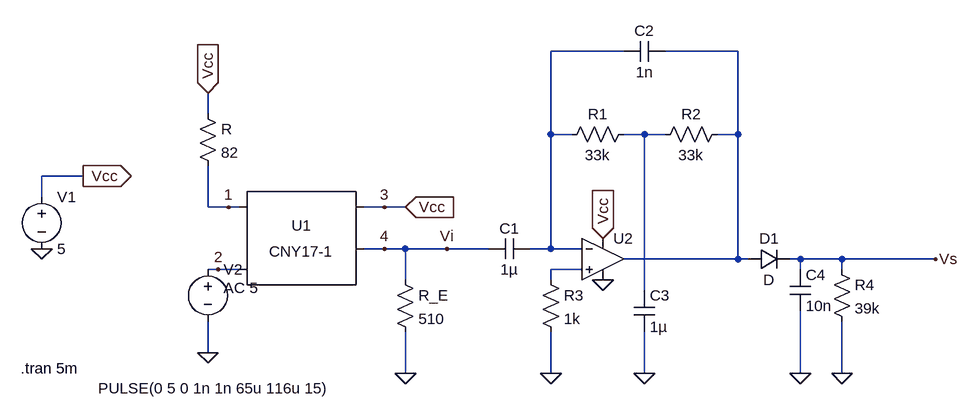
[diagram p0: schematic Recepteur_v1.asc]
Recepteur_v1.asc, the LTspice schematic file:
Version 4
SHEET 1 1756 680
WIRE 832 -112 720 -112
WIRE 1008 -112 896 -112
WIRE 192 -16 192 -48
WIRE 720 16 720 -112
WIRE 752 16 720 16
WIRE 864 16 832 16
WIRE 896 16 864 16
WIRE 1008 16 1008 -112
WIRE 1008 16 976 16
WIRE 0 80 -64 80
WIRE -64 112 -64 80
WIRE 192 128 192 64
WIRE 224 128 192 128
WIRE 240 128 224 128
WIRE 464 128 432 128
WIRE 496 128 464 128
WIRE 464 192 432 192
WIRE 496 192 464 192
WIRE 560 192 496 192
WIRE 624 192 560 192
WIRE 720 192 720 16
WIRE 720 192 688 192
WIRE 768 192 720 192
WIRE 1008 208 1008 16
WIRE 1008 208 832 208
WIRE 1024 208 1008 208
WIRE 1104 208 1088 208
WIRE 1168 208 1104 208
WIRE 1312 208 1168 208
WIRE 208 224 192 224
WIRE 240 224 208 224
WIRE 768 224 720 224
WIRE 1104 224 1104 208
WIRE 1168 224 1168 208
WIRE 496 240 496 192
WIRE 720 240 720 224
WIRE 864 256 864 16
WIRE 192 352 192 304
WIRE 496 384 496 320
WIRE 720 384 720 320
WIRE 864 384 864 320
WIRE 1104 384 1104 288
WIRE 1168 384 1168 304
FLAG -64 192 0
FLAG 0 80 Vcc
IOPIN 0 80 Out
FLAG 192 -48 Vcc
IOPIN 192 -48 In
FLAG 192 352 0
FLAG 496 384 0
FLAG 496 128 Vcc
IOPIN 496 128 In
FLAG 560 192 Vi
FLAG 720 384 0
FLAG 864 384 0
FLAG 800 176 Vcc
IOPIN 800 176 In
FLAG 800 240 0
FLAG 1104 384 0
FLAG 1168 384 0
FLAG 1312 208 Vs
FLAG 224 128 1
FLAG 208 224 2
FLAG 464 128 3
FLAG 464 192 4
SYMBOL voltage -64 96 R0
WINDOW 123 0 0 Left 2
WINDOW 39 0 0 Left 2
SYMATTR InstName V1
SYMATTR Value 5
SYMBOL Optos\\CNY17-1 336 192 R0
SYMATTR InstName U1
SYMBOL res 176 -32 R0
SYMATTR InstName R
SYMATTR Value 82
SYMBOL voltage 192 208 R0
WINDOW 3 -169 199 Left 2
WINDOW 123 24 44 Left 2
WINDOW 39 0 0 Left 2
SYMATTR Value PULSE(0 5 0 1n 1n 65u 116u 15)
SYMATTR Value2 AC 5
SYMATTR InstName V2
SYMBOL res 480 224 R0
SYMATTR InstName R_E
SYMATTR Value 510
SYMBOL cap 688 176 R90
WINDOW 0 0 32 VBottom 2
WINDOW 3 32 32 VTop 2
SYMATTR InstName C1
SYMATTR Value 1µ
SYMBOL res 848 0 R90
WINDOW 0 0 56 VBottom 2
WINDOW 3 32 56 VTop 2
SYMATTR InstName R1
SYMATTR Value 33k
SYMBOL res 992 0 R90
WINDOW 0 0 56 VBottom 2
WINDOW 3 32 56 VTop 2
SYMATTR InstName R2
SYMATTR Value 33k
SYMBOL cap 896 -128 R90
WINDOW 0 0 32 VBottom 2
WINDOW 3 32 32 VTop 2
SYMATTR InstName C2
SYMATTR Value 1n
SYMBOL Opamps\\UniversalOpamp2 800 208 R0
SYMATTR InstName U2
SYMBOL res 704 224 R0
SYMATTR InstName R3
SYMATTR Value 1k
SYMBOL cap 848 256 R0
SYMATTR InstName C3
SYMATTR Value 1µ
SYMBOL diode 1024 224 R270
WINDOW 0 32 32 VTop 2
WINDOW 3 0 32 VBottom 2
SYMATTR InstName D1
SYMBOL cap 1088 224 R0
SYMATTR InstName C4
SYMATTR Value 10n
SYMBOL res 1152 208 R0
SYMATTR InstName R4
SYMATTR Value 39k
TEXT -96 376 Left 2 !.tran 5m

The netlist it stands for:
* Recepteur_v1.asc
V1 3 0 5
XU1 1 2 3 4 NC_01 CNY17 Igain=.724m
R 3 1 82
V2 2 0 PULSE(0 5 0 1n 1n 65u 116u 15) AC 5
R_E 4 0 510
C1 N001 4 1µ
R1 N003 N001 33k
R2 N002 N003 33k
C2 N002 N001 1n
XU2 N004 N001 3 0 N002 level.2 Avol=1Meg GBW=10Meg Slew=10Meg ilimit=25m rail=0 Vos=0 phimargin=45 en=0 enk=0 in=0 ink=0 Rin=500Meg  ; pins IN+ IN- V+ V- OUT
R3 N004 0 1k
C3 N003 0 1µ
D1 N002 Vs D
C4 Vs 0 10n
R4 Vs 0 39k
.model D D
.lib standard.dio
.tran 5m
.lib CNY17.sub
.lib UniversalOpamps2.sub
.backanno
.end